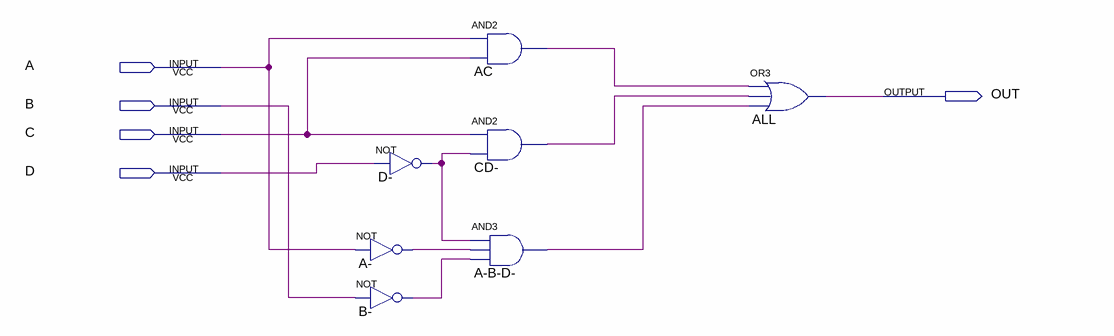
[diagram p0: schematic sheet]
// Quartus schematic e.bdf as structural Verilog: 7 symbols, 5 pins
module e (
  input  A,
  input  B,
  input  C,
  input  D,
  output OUT
);

  wire A__out, A_B_D__out, AC_out, B__out, CD__out, D__out;

  not \D-  (D__out, D);
  not \A-  (A__out, A);
  not \B-  (B__out, B);
  and AC (AC_out, A, C);
  and \CD-  (CD__out, C, D__out);
  and \A-B-D-  (A_B_D__out, D__out, A__out, B__out);
  or ALL (OUT, AC_out, CD__out, A_B_D__out);
endmodule
